# Altium schematic sheet Instrument_Service.SchDoc
size A
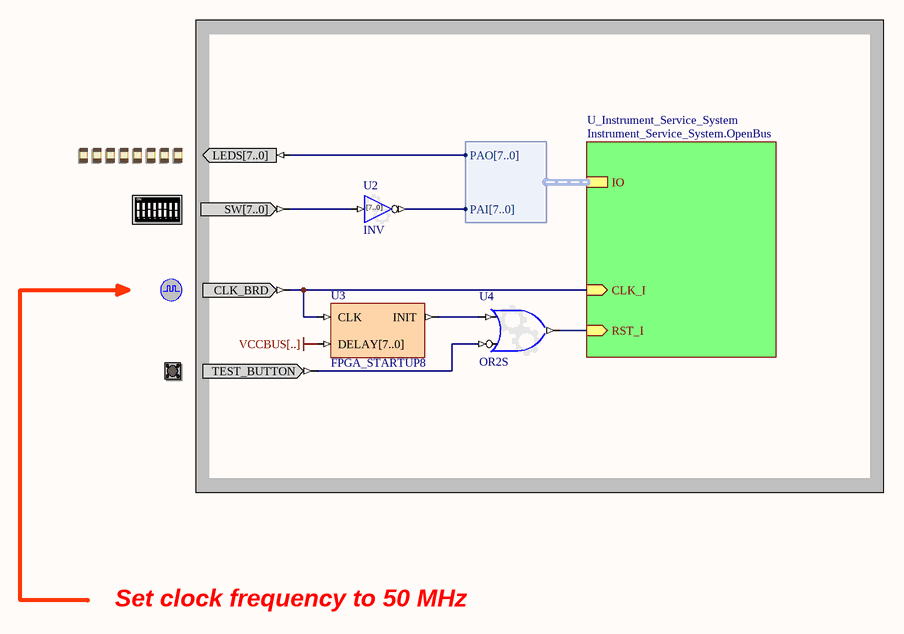
[diagram p0: Instrument_Service.SchDoc]

## Parts
(Parts that share a designator on the sheet are numbered #1, #2 ... from top to bottom, then left to right.)
?#1  LED  (value not drawn)
?#2  DIPSWITCH  (value not drawn)
?#3  CLOCK_BOARD  (value not drawn)
?#4  TEST_BUTTON  (value not drawn)
U2  INV
U3  FPGA_STARTUP8
U4  OR2S

## Sub-sheets
U_Instrument_Service_System = Instrument_Service_System.OpenBus: RST_I (in), CLK_I (in), IO (harness WB_PRTIO_IO_1_1)

## Harnesses
WB_PRTIO_IO_1_1: PAO[7..0], PAI[7..0]

## Nets
VCCBUS[..]: U3.DELAY[7..0]
Net?#1_LEDS[7..0]: ?#1.LEDS[7..0] ; sheet U_Instrument_Service_System/IO.PAO[7..0]
Net?#2_SW[7..0]: ?#2.SW[7..0] U2.I[7..0]
Net?#3_CLK_BRD: ?#3.CLK_BRD U3.CLK ; sheet U_Instrument_Service_System/CLK_I
Net?#4_TEST_BUTTON: ?#4.TEST_BUTTON U4.I1
NetU2_O[7..0]: U2.O[7..0] ; sheet U_Instrument_Service_System/IO.PAI[7..0]
NetU3_INIT: U3.INIT U4.I0
NetU4_O: U4.O ; sheet U_Instrument_Service_System/RST_I

## Notes on the sheet
- Set clock frequency to 50 MHz
- Title
- Size:
- Date:
- A
- Number:
- Time:
- Revision:
- Sheet
- of
- File:
- (in symbol DIPSWITCH) ON; 1; 2; 3; 4; 5; 6; 7; 8
- (in symbol INV) [7..0]

## Library data of the parts
?#1 = LED: Bank of eight Red LEDs; PortComponent: True; Published: 19-Nov-2003; Publisher: Altium Limited; HelpURL: TR0143 Technical Reference Manual for Altium's Desktop NanoBoard NB2DSK01.pdf#page=51
?#2 = DIPSWITCH: 8-Way Dip-Switch; PortComponent: True; Published: 19-Nov-2003; Publisher: Altium Limited; HelpURL: TR0143 Technical Reference Manual for Altium's Desktop NanoBoard NB2DSK01.pdf#page=51
?#3 = CLOCK_BOARD: Global System Clock Supply; PortComponent: True; Published: 19-Nov-2003; Publisher: Altium Limited; HelpURL: TR0143 Technical Reference Manual for Altium's Desktop NanoBoard NB2DSK01.pdf#page=41; UseInDSF: True
?#4 = TEST_BUTTON: Test / Reset Button; PortComponent: True; Published: 19-Nov-2003; Publisher: Altium Limited; HelpURL: TR0143 Technical Reference Manual for Altium's Desktop NanoBoard NB2DSK01.pdf#page=53
U2 = INV: Configurable Inverter; ConfigurationParameters: {}Version[1.0]{}SignalCount[1]{}SignalWidth0[8]{}OutputOption0[Inverted]{}EnableMode[None]{}ShowPinNames[False]{}; ConfiguratorName: GENERIC_BUFFER; LastRevisionNo: 1.00.00; Published: 10-Oct-2008; Publisher: Altium Limited
U3 = FPGA_STARTUP8: FPGA Startup With 8 Bit Delay; Published: 9-Dec-2004; Publisher: Altium Limited; HelpURL: CR0119 FPGA_STARTUPx Powerup Delay Unit.pdf; LastRevisionNo: 1.00.00; ComponentLink1Description: Core &Resource Usage; ComponentLink1URL: CR0139 FPGA Peripheral Resource Usage.pdf#page=11
U4 = GATE: Configurable Generic Gate; ConfiguratorName: GENERIC_GATE; ConfigurationParameters: {}Version[1.0]{}GateKind[OR]{}BusInput[False]{}GateInputType[Bit]{}GateOutputOption[Normal]{}BusWidth[8]{}RegisterOutputs[False]{}NegativeClockEdge[False]{}InputCount[2]{}InputInvert0[False]{}InputInvert1[True]{}; LastRevisionNo: 1.00.00; Published: 3-Sep-2008; Publisher: Altium Limited